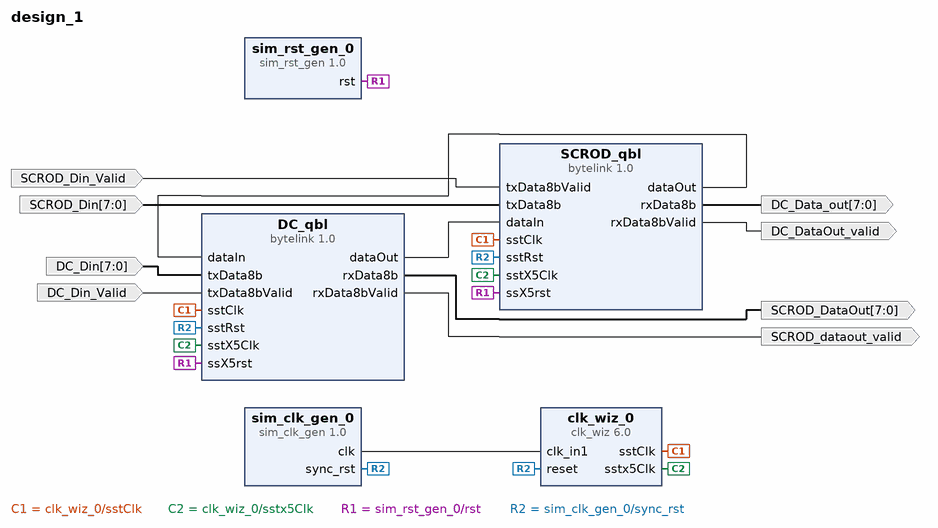
[diagram p0: block diagram of the top level]
# Vivado block design design_1, xc7z020clg400-1, Vivado 2020.2
create_bd_design design_1

create_bd_port -dir O -from 7 -to 0 -type data SCROD_DataOut
create_bd_port -dir I SCROD_Din_Valid
create_bd_port -dir O SCROD_dataout_valid
create_bd_port -dir I -from 7 -to 0 -type data DC_Din
create_bd_port -dir I -from 7 -to 0 -type data SCROD_Din
create_bd_port -dir I DC_Din_Valid
create_bd_port -dir O -from 7 -to 0 -type data DC_Data_out
create_bd_port -dir O DC_DataOut_valid

create_bd_cell -type ip -vlnv IDLAB:HMB:bytelink:1.0 SCROD_qbl
create_bd_cell -type ip -vlnv IDLAB:HMB:bytelink:1.0 DC_qbl
create_bd_cell -type ip -vlnv xilinx.com:ip:sim_clk_gen:1.0 sim_clk_gen_0
set_property -dict {CONFIG.FREQ_HZ 25000000 CONFIG.RESET_POLARITY ACTIVE_HIGH} [get_bd_cells sim_clk_gen_0]
create_bd_cell -type ip -vlnv xilinx.com:ip:clk_wiz:6.0 clk_wiz_0
set_property -dict [list \
  CONFIG.CLKOUT1_JITTER 356.129 \
  CONFIG.CLKOUT1_REQUESTED_OUT_FREQ 25 \
  CONFIG.CLKOUT2_JITTER 220.126 \
  CONFIG.CLKOUT2_PHASE_ERROR 237.727 \
  CONFIG.CLKOUT2_REQUESTED_OUT_FREQ 125 \
  CONFIG.CLKOUT2_USED true \
  CONFIG.CLK_OUT1_PORT sstClk \
  CONFIG.CLK_OUT2_PORT sstx5Clk \
  CONFIG.MMCM_CLKOUT0_DIVIDE_F 40.000 \
  CONFIG.MMCM_CLKOUT1_DIVIDE 8 \
  CONFIG.NUM_OUT_CLKS 2 \
  CONFIG.RESET_PORT reset \
  CONFIG.RESET_TYPE ACTIVE_HIGH \
  CONFIG.USE_LOCKED false \
  CONFIG.USE_RESET true \
] [get_bd_cells clk_wiz_0]
create_bd_cell -type ip -vlnv xilinx.com:ip:sim_rst_gen:1.0 sim_rst_gen_0
set_property -dict {CONFIG.PULSE_PERIOD 8 CONFIG.RST_PERIOD 8 CONFIG.RST_POLARITY ACTIVE_HIGH} [get_bd_cells sim_rst_gen_0]

# ---- connections ----

connect_bd_net [get_bd_pins SCROD_qbl/dataOut] [get_bd_pins DC_qbl/dataIn]
connect_bd_net [get_bd_pins sim_clk_gen_0/clk] [get_bd_pins clk_wiz_0/clk_in1]
connect_bd_net [get_bd_pins clk_wiz_0/sstClk] [get_bd_pins SCROD_qbl/sstClk] [get_bd_pins DC_qbl/sstClk]
connect_bd_net [get_bd_pins clk_wiz_0/sstx5Clk] [get_bd_pins SCROD_qbl/sstX5Clk] [get_bd_pins DC_qbl/sstX5Clk]
connect_bd_net [get_bd_pins sim_rst_gen_0/rst] [get_bd_pins SCROD_qbl/ssX5rst] [get_bd_pins DC_qbl/ssX5rst]
connect_bd_net [get_bd_pins sim_clk_gen_0/sync_rst] [get_bd_pins SCROD_qbl/sstRst] [get_bd_pins clk_wiz_0/reset] [get_bd_pins DC_qbl/sstRst]
connect_bd_net [get_bd_pins DC_qbl/dataOut] [get_bd_pins SCROD_qbl/dataIn]
connect_bd_net [get_bd_ports SCROD_Din_Valid] [get_bd_pins SCROD_qbl/txData8bValid]
connect_bd_net [get_bd_pins DC_qbl/rxData8b] [get_bd_ports SCROD_DataOut]
connect_bd_net [get_bd_pins DC_qbl/rxData8bValid] [get_bd_ports SCROD_dataout_valid]
connect_bd_net [get_bd_ports SCROD_Din] [get_bd_pins SCROD_qbl/txData8b]
connect_bd_net [get_bd_ports DC_Din] [get_bd_pins DC_qbl/txData8b]
connect_bd_net [get_bd_ports DC_Din_Valid] [get_bd_pins DC_qbl/txData8bValid]
connect_bd_net [get_bd_pins SCROD_qbl/rxData8b] [get_bd_ports DC_Data_out]
connect_bd_net [get_bd_pins SCROD_qbl/rxData8bValid] [get_bd_ports DC_DataOut_valid]

validate_bd_design
save_bd_design
